# Altium schematic sheet Main_Sheet.SchDoc: Main Schematic
size A; Author: GAINS; DocumentNumber: N/A; Revision: 001; SheetNumber: 1; SheetTotal: 4
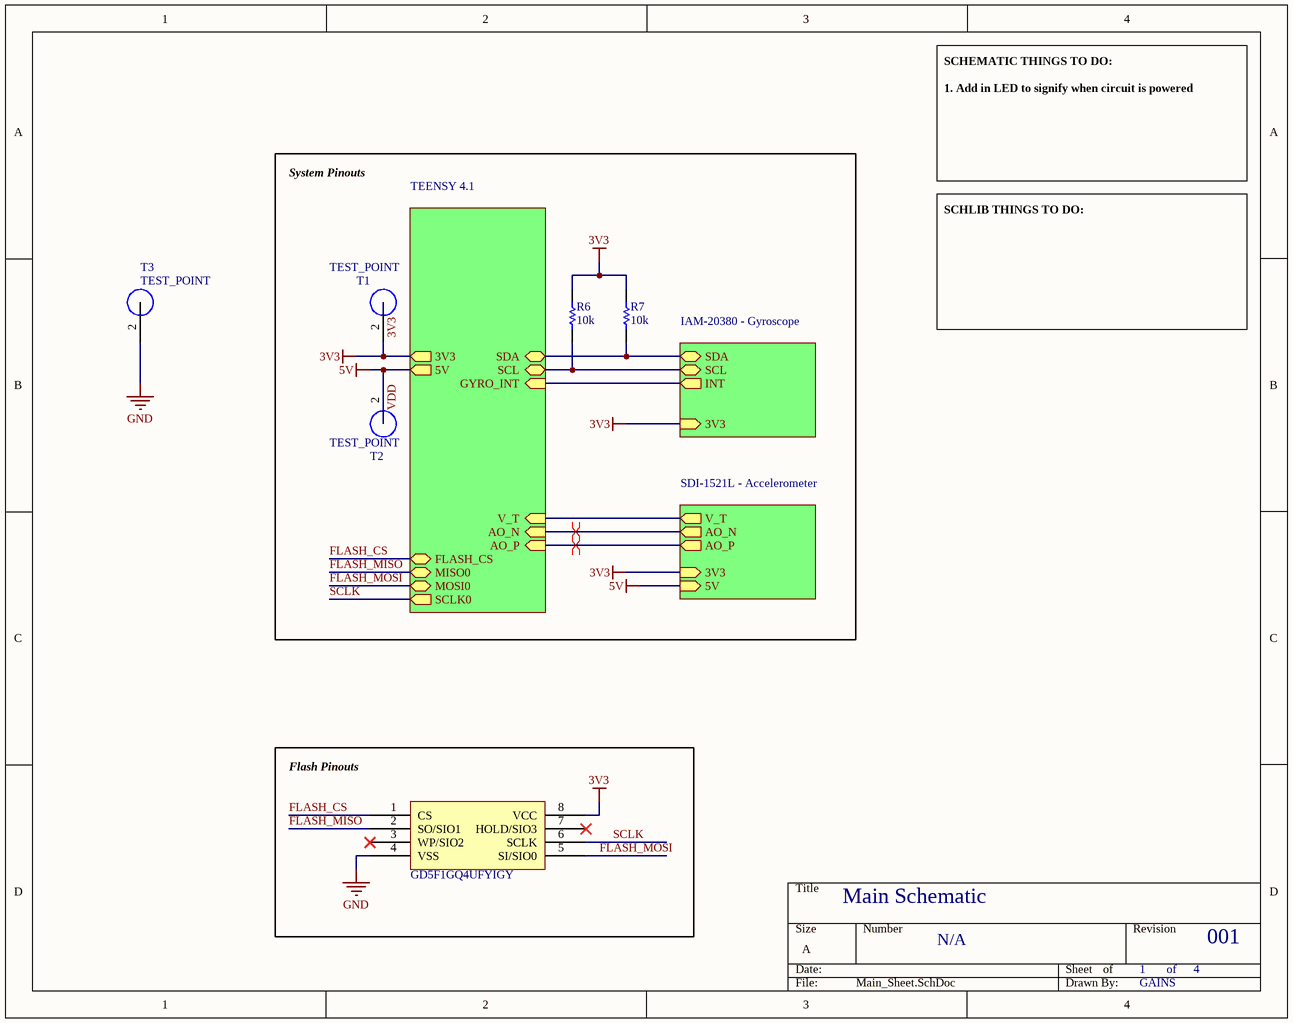
[diagram p0: Main_Sheet.SchDoc]

## Parts
?  GD5F1GQ4UFYIGY  [SON127P800X80_HS-9N]
R6  10k  [RESC2013X50X30LL20T20]
R7  10k  [RESC2013X50X30LL20T20]
T1  TEST_POINT  [PCBComponent_1]
T2  TEST_POINT  [PCBComponent_1]
T3  TEST_POINT  [PCBComponent_1]

## Blocks framed on the sheet
System Pinouts: R6 R7 T1 T2
Flash Pinouts: ?

## Sub-sheets
IAM-20380 - Gyroscope = Gyroscope.SchDoc: 3V3 (in), SCL (bidir), SDA (bidir), INT (out)
SDI-1521L - Accelerometer = Accelerometer.SchDoc: 5V (in), AO_N (out), AO_P (out), V_T (out), 3V3 (in)
TEENSY 4.1 = Microcontroller.SchDoc: 3V3 (out), SDA (bidir), SCL (bidir), 5V (out), AO_P (in), AO_N (in), V_T (in), GYRO_INT (in), FLASH_CS (bidir), MISO0 (bidir), MOSI0 (bidir), SCLK0 (out)

## Nets
3V3: ?.8(VCC) R6.2 R7.2 T1.2 ; sheet TEENSY 4.1/3V3, sheet SDI-1521L - Accelerometer/3V3, sheet IAM-20380 - Gyroscope/3V3
GND: ?.4(VSS)
VDD: T2.2 ; sheet TEENSY 4.1/5V, sheet SDI-1521L - Accelerometer/5V  [also labelled 5V]
FLASH_CS: ?.1(CS) ; sheet TEENSY 4.1/FLASH_CS
FLASH_MISO: ?.2(SO/SIO1) ; sheet TEENSY 4.1/MISO0
FLASH_MOSI: ?.5(SI/SIO0) ; sheet TEENSY 4.1/MOSI0
SCLK: ?.6(SCLK) ; sheet TEENSY 4.1/SCLK0
NetR6_1: R6.1 ; sheet TEENSY 4.1/SCL, sheet IAM-20380 - Gyroscope/SCL
NetR7_1: R7.1 ; sheet TEENSY 4.1/SDA, sheet IAM-20380 - Gyroscope/SDA
(unnamed): sheet TEENSY 4.1/AO_P, sheet SDI-1521L - Accelerometer/AO_P
(unnamed): sheet TEENSY 4.1/AO_N, sheet SDI-1521L - Accelerometer/AO_N
(unnamed): sheet TEENSY 4.1/V_T, sheet SDI-1521L - Accelerometer/V_T
(unnamed): sheet TEENSY 4.1/GYRO_INT, sheet IAM-20380 - Gyroscope/INT

Not connected (* = marked no-connect by the designer): ? 3(WP/SIO2)* 7(HOLD/SIO3)*; T3 2

## Layout directives
differential pair: (no net found under the mark)

## Notes on the sheet
- SCHEMATIC THINGS TO DO:
  1. Add in LED to signify when circuit is powered
- SCHLIB THINGS TO DO:
- of

## Library data of the parts
? = GD5F1GQ4UFYIGY: FLASH - NAND Memory IC 1Gbit SPI - Quad I/O 120 MHz 8-WSON (6x8) - GD5F1GQ4UFYIGY; Supplier 1: Digi-Key; Supplier Part Number 1: 1970-1081-1-ND
R6 R7 = CMP-2001-04257-1: CRCW080510K0JNTA; Manufacturer: Vishay Dale; Part Number: CRCW080510K0JNTA
T1-T3 = TEST_POINT: Test Point